# EasyEDA Pro project MFU.eprj, board HUB_STEP
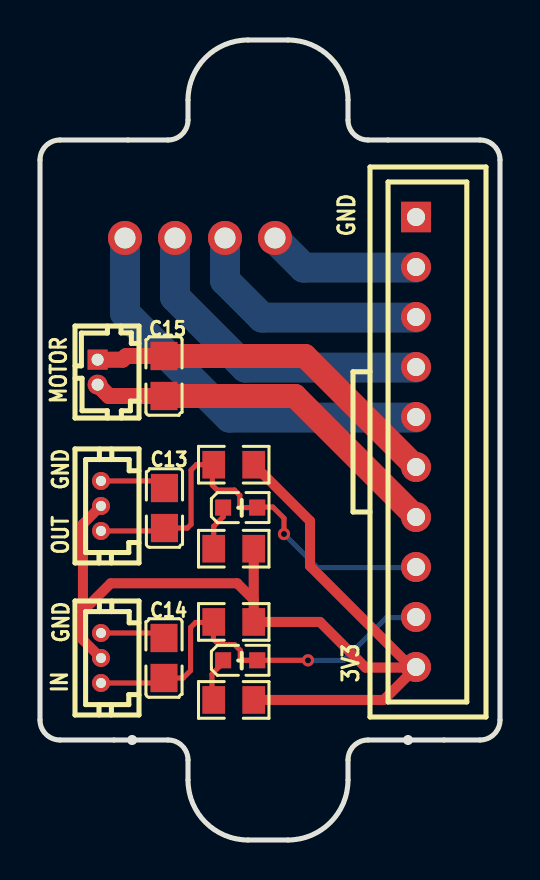
[diagram p5: board, top side]
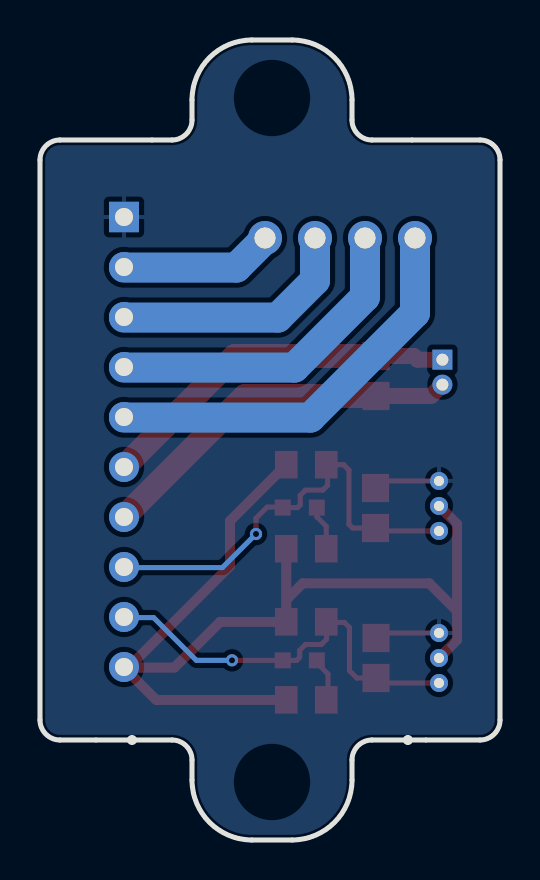
[diagram p6: board, bottom side, seen from below]

Outline 23 x 40 mm; copper layers: Top Layer, Bottom Layer. Coordinates in mm from the lower left corner of the outline.
Outline path: 0,34 0,6 arc(0.29,5.29) 1,5 6.4,5 arc(7.11,4.71) 7.4,4 7.4,3 arc(8.28,0.88) 10.4,0 12.4,0 arc(14.52,0.88) 15.4,3 15.4,4 arc(15.69,4.71) 16.4,5 22,5 arc(22.71,5.29) 23,6 23,34 arc(22.71,34.71) 22,35 16.4,35 arc(15.69,35.29) 15.4,36 15.4,37 arc(14.52,39.12) 12.4,40 10.4,40 arc(8.28,39.12) 7.4,37 7.4,36 arc(7.11,35.29) 6.4,35 1,35 arc(0.29,34.71) 0,34
Stack: Top Layer 0.035mm / Dielectric1 1.51mm FR4 er 4.5 / Bottom Layer 0.035mm

## Design rules (mm)
template: Custom Config
spacing copperThickness1oz (default): track to track 0.102, other pairs 0.152 to 0.3
spacing copperThickness2oz: track to track 0.203, other pairs 0.152 to 0.3
track width copperThickness1oz (default): min 0.127, default 0.254, max 2.54
track width copperThickness2oz: min 0.203, default 0.254, max 2.54
track width STEP: min 0.127, default 1.5, max 2.54
track width 3V3: min 0.127, default 0.5, max 2.54
track width DC: min 0.127, default 1.2, max 2.54
differential pair differentialPair (default): width min 0.127, default 0.254, max 2.54; gap min 0.152, default 0.152
via viaSize (default): diameter min 0.5, default 0.61, max 10; hole min 0.3, default 0.305, max 6.3
net DC+ uses DC
net DC- uses DC
net A1 uses STEP
net A2 uses STEP
net B1 uses STEP
net B2 uses STEP
net 3V3 uses 3V3

## Placement (name value [footprint] x y rotation side)
C13  0.1u  [C0805]  6.22 16.6 90 top
C14  0.1u  [C0805]  6.2 9.1 90 top
C15  0.1u  [C0805]  6.2 23.2 270 top
CN2  ZH1.25-2P  [CONN-TH_2P-P1.25-V-M_721]  2.88 23.39 90 top
LED5  -  [LED0603-R-RD]  10.01 8.98 0 top
LED6  -  [LED0603-R-RD]  10.01 16.62 0 top
R18  10k  [R0805]  9.69 7 0 top
R19  10k  [R0805]  9.69 10.9 0 top
R20  10k  [R0805]  9.69 14.56 0 top
R21  10k  [R0805]  9.69 18.77 0 top
U1  XH2.54_4P_直插  [CONN-TH_4P-P2.50-XH2.54-4P]  8 30.1 180 top
U5  电池端子3pin  [CONN-TH_3P-P1.25_C9900015739]  3.05 9.1 90 top
U6  电池端子3pin  [CONN-TH_3P-P1.25_C9900015739]  3.05 16.7 90 top
U7  BX-HA2.54-10PZZ  [CONN-TH_10P-P2.50_BX-HA2.54-10PZZ]  18.8 19.9 270 top

## Footprints (pads in the part's own frame, mm; a bottom-side part is the same pattern mirrored in y, then rotated)
C0805
  rect 1.41x1.35 smd: 1(-1,0) 2(1,0)
CONN-TH_2P-P1.25-V-M_721
  rect 1x1 hole 0.6: 1(0.625,0)
  round 1 hole 0.6: 2(-0.625,0)
CONN-TH_3P-P1.25_C9900015739
  round 0.9 hole 0.5: 1(-1.25,0) 2(0,0) 3(1.25,0)
CONN-TH_4P-P2.50-XH2.54-4P
  round 1.7 hole 1.05: 1(3.75,0) 2(1.25,0) 3(-1.25,0) 4(-3.75,0)
CONN-TH_10P-P2.50_BX-HA2.54-10PZZ
  rect 1.524x1.5 hole 0.9: 1(-11.25,0)
  round 1.5 hole 0.9: 2(-8.75,0) 3(-6.25,0) 4(-3.75,0) 5(-1.25,0) 6(1.25,0) 7(3.75,0) 8(6.25,0) 9(8.75,0) 10(11.25,0)
LED0603-R-RD
  rect 0.8x0.8 smd: 1(0.851,0) 2(-0.851,0)
R0805
  rect 1.133x1.377 smd: 1(-1,0) 2(1,0)

## Nets
As in the schematic.

## Via types
v1: diameter 0.61, hole 0.305, Top Layer to Bottom Layer, 2 vias

## Routing (per net, layer and track width the routed paths; a pad name or vN(x,y) marks a point on that pad's centre or on a via; arc(x,y) is an arc through that point)
3V3: length 52.7
  Top Layer w0.5: U6.2 2.15,15.8 2.15,11.45 ; 18.58,8.62 18.8,8.62 17.19,7 R18.2 ; 18.58,8.62 13.5,13.7 13.5,15.95 R21.2 ; 18.58,8.62 16.28,8.62 14,10.9 R19.2 10.69,12.01 ; 2.15,11.45 3.53,12.83 9.86,12.83 10.69,12.01 ; 2.15,11.45 2.15,10 U5.2 ; 10.69,12.01 R20.2
GND: length 6.6
  Top Layer w0.254: C13.2 5.87,17.95 U6.3 ; U5.3 5.95,10.35 C14.2
A1: length 20.5
  Bottom Layer w1.5: U1.1 4.25,26.35 9.48,21.12 18.8,21.12
A2: length 16.5
  Bottom Layer w1.5: U1.2 6.75,27.15 10.28,23.62 18.8,23.62
B1: length 12.4
  Bottom Layer w1.5: 18.8,26.12 11.11,26.12 9.25,27.98 U1.3
B2: length 7.7
  Bottom Layer w1.5: 18.8,28.62 13.18,28.62 11.75,30.05 U1.4
DC+: length 18.3
  Top Layer w0.8: C15.1 4.31,24.2 4.13,24.02 CN2.1
  Top Layer w1.2: U7.6 13.25,24.2 C15.1
DC-: length 18.7
  Top Layer w0.8: CN2.2 3.45,22.2 C15.2
  Top Layer w1.2: U7.7 12.75,22.2 C15.2
SW_IN: length 20.7
  Top Layer w0.254: 8.67,10.89 8.67,10.04 8.94,9.77 9.72,9.77 10.02,9.48 10.02,9.13 10.16,8.98 LED5.1 v1(13.4,8.98) ; 8.67,10.89 8.66,10.88 7.78,10.88 7.53,10.63 7.53,8.47 7.16,8.1 C14.1 5.95,7.85 U5.1 ; 8.67,10.89 R19.1
  Bottom Layer w0.254: v1(13.4,8.98) 15.18,8.98 17.32,11.12 18.8,11.12
SW_OUT: length 22.3
  Top Layer w0.254: LED6.1 10.12,16.62 9.99,16.75 9.99,17.23 9.72,17.5 8.86,17.5 8.62,17.74 8.62,18.7 R21.1 7.82,18.77 7.55,18.5 7.55,15.78 7.37,15.6 C13.1 6.08,15.45 U6.1 ; 10.86,16.65 11.64,16.65 12.2,16.09 v1(12.2,15.3)
  Bottom Layer w0.254: 18.8,13.62 13.88,13.62 v1(12.2,15.3)
$1N1154: length 2.2
  Top Layer w0.254: R18.1 8.6,7.09 8.6,8.3 9.16,8.86 LED5.2
$1N1286: length 2.3
  Top Layer w0.254: R20.1 8.69,15.69 9.16,16.16 9.16,16.65

## Copper pours and planes (outline as drawn; the poured copper is in the pictures)
GND on Bottom Layer: -3.24,42.2 24.82,42.2 24.82,-3.42 -3.24,-3.42

## Text on the board
Top Silkscreen Layer: MOTOR | GND | OUT | IN | 3V3
